# Altium schematic sheet CosmoLink_Alpha_V0.00.SchDoc
size A
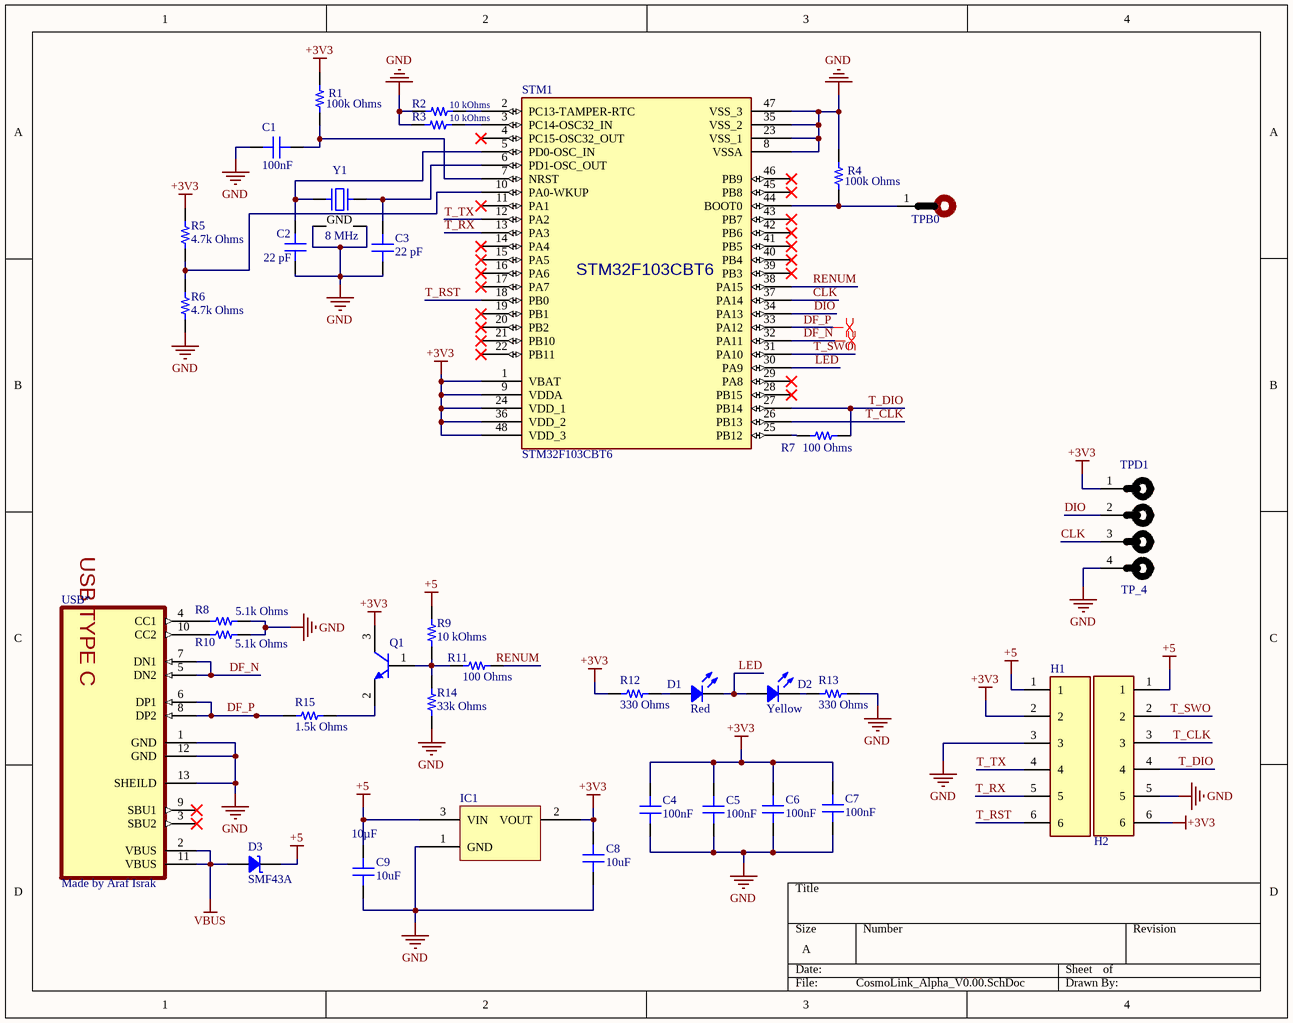
[diagram p0: CosmoLink_Alpha_V0.00.SchDoc]

## Parts
C1  Capacitance: 100nF  [CAP 0603_1608]  (hidden comment: 0.1µF)
C2  22 pF  [CAP 0603_1608]
C3  22 pF  [CAP 0603_1608]
C4  Capacitance: 100nF  [CAP 0603_1608]  (hidden comment: 0.1µF)
C5  Capacitance: 100nF  [CAP 0603_1608]  (hidden comment: 0.1µF)
C6  Capacitance: 100nF  [CAP 0603_1608]  (hidden comment: 0.1µF)
C7  Capacitance: 100nF  [CAP 0603_1608]  (hidden comment: 0.1µF)
C8  Capacitance: 10uF  [CAP 0603_1608]  (hidden comment: 10µF)
C9  Capacitance: 10uF  [CAP 0603_1608]  (hidden comment: 10µF)
D1  Red  [LED 0603_1608 RED]
D2  Yellow  [LED 0603_1608 YELLOW]
D3  SMF43A  [SOD123F]
H1  2.54mm_TH_1x6_pin_header  [2.54mm_TH_1x6_pin_header]  (value not drawn)
H2  2.54mm_TH_1x6_pin_header  [2.54mm_TH_1x6_pin_header]  (value not drawn)
IC1  AP2138N-3.3TRG1  [DIODES SOT-23-3 N]  (value not drawn)
Q1  DNLS160-7  [DIODES SOT-23-3]  (value not drawn)
R1  100k Ohms  [RES 0603_1608]
R2  10 kOhms  [RES 0603_1608]
R3  10 kOhms  [RES 0603_1608]
R4  100k Ohms  [RES 0603_1608]
R5  4.7k Ohms  [RES 0603_1608]
R6  4.7k Ohms  [RES 0603_1608]
R7  100 Ohms  [RES 0603_1608]
R8  5.1k Ohms  [RES 0603_1608]
R9  10 kOhms  [RES 0603_1608]
R10  5.1k Ohms  [RES 0603_1608]
R11  100 Ohms  [RES 0603_1608]
R12  330 Ohms  [RES 0603_1608]
R13  330 Ohms  [RES 0603_1608]
R14  33k Ohms  [RES 0603_1608]
R15  1.5k Ohms  [RES 0603_1608]
STM1  STM32F103CBT6  [STM32F103CBT6_FOOTPRINT]
TPB0  TP_1  [TP1]  (value not drawn)
TPD1  TP_4  [TP4]
USB*  Made by Araf Israk  [USB TYPE-C 24P SMD]
Y1  8 MHz  [EPSON TSX-3225]

## Nets
+3V3: C4.2 C5.2 C6.2 C7.2 C8.2 H1.2 H2.6 IC1.2(VOUT) Q1.3(C) R1.1 R5.2 R12.1 STM1.1(VBAT) STM1.9(VDDA) STM1.24(VDD_1) STM1.36(VDD_2) STM1.48(VDD_3) TPD1.1(TP1)
+5: C9.2 D3.2 H1.1 H2.1 IC1.3(VIN) R9.2
GND: C1.1 C2.1 C3.1 C4.1 C5.1 C6.1 C7.1 C8.1 C9.1 H1.3 H2.5 IC1.1(GND) R2.1 R3.1 R4.1 R6.1 R8.2 R10.2 R13.2 R14.1 STM1.8(VSSA) STM1.23(VSS_1) STM1.35(VSS_2) STM1.47(VSS_3) TPD1.4(TP4) USB*.1(GND) USB*.12(GND) USB*.13(SHEILD) Y1.2(GND) Y1.4(GND)
VBUS: D3.1 USB*.2(VBUS) USB*.11(VBUS)
CLK: STM1.37(PA14) TPD1.3(TP3)
DF_N: STM1.32(PA11) USB*.5(DN2) USB*.7(DN1)
DF_P: R15.1 STM1.33(PA12) USB*.6(DP1) USB*.8(DP2)
DIO: STM1.34(PA13) TPD1.2(TP2)
LED: D1.2 D2.1 STM1.30(PA9)
RENUM: R11.2 STM1.38(PA15)
T_CLK: H2.3 STM1.26(PB13)
T_DIO: H2.4 R7.2 STM1.27(PB14)
T_RST: H1.6 STM1.18(PB0)
T_RX: H1.5 STM1.13(PA3)
T_SWO: H2.2 STM1.31(PA10)
T_TX: H1.4 STM1.12(PA2)
NetC1_2: C1.2 R1.2 STM1.7(NRST)
NetC2_2: C2.2 STM1.5(PD0-OSC_IN) Y1.1
NetC3_2: C3.2 STM1.6(PD1-OSC_OUT) Y1.3
NetD1_1: D1.1 R12.2
NetD2_2: D2.2 R13.1
NetQ1_1: Q1.1(B) R9.1 R11.1 R14.2
NetQ1_2: Q1.2(E) R15.2
NetR2_2: R2.2 STM1.2(PC13-TAMPER-RTC)
NetR3_2: R3.2 STM1.3(PC14-OSC32_IN)
NetR4_2: R4.2 STM1.44(BOOT0) TPB0.1(TP1)
NetR5_1: R5.1 R6.2 STM1.10(PA0-WKUP)
NetR7_1: R7.1 STM1.25(PB12)
NetR8_1: R8.1 USB*.4(CC1)
NetR10_1: R10.1 USB*.10(CC2)

Not connected (* = marked no-connect by the designer): STM1 4(PC15-OSC32_OUT)* 11(PA1)* 14(PA4)* 15(PA5)* 16(PA6)* 17(PA7)* 19(PB1)* 20(PB2)* 21(PB10)* 22(PB11)* 28(PB15)* 29(PA8)* 39(PB3)* 40(PB4)* 41(PB5)* 42(PB6)* 43(PB7)* 45(PB8)* 46(PB9)*; USB* 3(SBU2)* 9(SBU1)*

## Layout directives
differential pair: DF_N, DF_P

## Notes on the sheet
- (in symbol USB TYPE-C 24P SMD) USB TYPE C

## Library data of the parts
C1 C4-C9 = 06031C104KAT2A: CAP CER 0.1UF 100V X7R 0603; manufacturer: AVX Corporation; Tolerance: ±10%; Part Number: 06031C104KAT2A; Applications: General Purpose; componentlink1description: Datasheet; componentlink1url: http://datasheets.avx.com/X7RDielectric.pdf; componentlink2description: DigiKey Link; componentlink2url: http://digikey.com/product-detail/en/avx-corporation/06031C104KAT2A/478-10047-1-ND/6564270; Device Package: 0603 (1608 Metric); lastupdated: 9/2/2020 1:03:14 AM; Lifecycle Status: Active; Minimum Order: 1; Mounting Type: Surface Mount, MLCC; Operating Temperature: -55°C ~ 125°C; Package / Case: 0603 (1608 Metric); packaging: TapeAndReel; partid: 14077; Part Status: Active; price: 0.03; series: -; Size / Dimension: 0.063" L x 0.032" W (1.60mm x 0.81mm); Supplier 1: DigiKey; Supplier Part Number 1: 478-10047-1-ND; Temperature Coefficient: X7R; Thickness (Max): 0.037" (0.94mm); Voltage - Rated: 100V
  C1 C4-C7: value: 0.1µF
  C8 C9: value: 10µF
C2 C3 = C06CF220F-9ZN-X0T: HIGH-Q MLCC (CF): 0603, 22 PF (1; manufacturer: Knowles Dielectric Labs; Temperature Coefficient: C0G, NP0; Tolerance: ±1%; Voltage - Rated: 250V; Part Number: C06CF220F-9ZN-X0T; Capacitance: 22 pF; Applications: RF, Microwave, High Frequency; componentlink1description: Datasheet; componentlink1url: https://media.digikey.com/pdf/Data%20Sheets/Knowles%20Dielectric%20Labs%20PDFs/MLC_SLC_Cap_Cat.pdf; componentlink2description: DigiKey Link; componentlink2url: https://www.digikey.com/en/products/detail/knowles-dielectric-labs/C06CF220F-9ZN-X0T/19203937; Device Package: 0603 (1608 Metric); Features: High Q, Low Loss; lastupdated: 2/9/2024 8:08:55 PM; Lifecycle Status: Active; Minimum Order: 1; Mounting Type: Surface Mount, MLCC; Operating Temperature: -55°C ~ 125°C; Package / Case: 0603 (1608 Metric); packaging: TapeAndReel; partid: 55085; Part Status: Active; price: 2.56; series: CF; Size / Dimension: 0.060" L x 0.030" W (1.52mm x 0.76mm); Supplier 1: DigiKey; Supplier Part Number 1: 1761-C06CF220F-9ZN-X0TCT-ND; Thickness (Max): 0.031" (0.80mm); value: 22 pF
D1 = VFHR1111C-3BY2A-TR: LED RED DIFFUSED 1608 SMD; Manufacturer: Stanley Electric Co; Configuration: Standard; Current - Test: 20mA; Lens Color: White; Lens Size: 1.10mm x 0.80mm; Lens Style: Rectangle with Flat Top; Millicandela Rating: 91mcd; Viewing Angle: 140°; Voltage - Forward (Vf) (Typ): 1.9V; Wavelength - Dominant: 626nm; Wavelength - Peak: 635nm; Part Number: VFHR1111C-3BY2A-TR; Color: Red; ComponentLink1Description: Datasheet; ComponentLink1URL: http://www.stanley-components.com/php/downloaddatafile.php?rp=0,VFHR1111C-3BY2A-TR_e.pdf; ComponentLink2Description: DigiKey Link; ComponentLink2URL: https://www.digikey.com/en/products/detail/stanley-electric-co/VFHR1111C-3BY2A-TR/6615658; Device Package: 0603 (1608 Metric); Height (Max): 0.80mm; LastUpdated: 6/3/2024 7:59:48 PM; Lens Transparency: Diffused; Lifecycle Status: Active; Minimum Order: 1; Mounting Type: Surface Mount; Package / Case: 0603 (1608 Metric); Packaging: TapeAndReel; PartId: 373; Part Status: Active; Price: 0.06; Series: -; Size / Dimension: 1.60mm L x 0.80mm W; Supplier 1: DigiKey; Supplier Part Number 1: 404-1310-1-ND; Supplier Device Package: 1608; Value: Red
D2 = 5973405507F: LED YELLOW 0603 SMD; Manufacturer: Dialight; Configuration: Standard; Current - Test: 20mA; Lens Color: 0.68mm; Lens Size: 1.20mm x 0.80mm; Lens Style: Rectangle with Flat Top; Millicandela Rating: 224mcd; Voltage - Forward (Vf) (Typ): 2.1V; Wavelength - Dominant: 590nm; Part Number: 5973405507F; Color: Yellow; ComponentLink1Description: Datasheet; ComponentLink1URL: http://www.dialightsignalsandcomponents.com/Assets/Drawings/2D_Drawings_DrawingDetailedSpec/NewDrawings/18369A.pdf; ComponentLink2Description: DigiKey Link; ComponentLink2URL: https://www.digikey.com/en/products/detail/dialight/5973405507F/9385433; Device Package: 0603 (1608 Metric); Height (Max): 0.68mm; LastUpdated: 6/3/2024 8:01:10 PM; Lifecycle Status: Active; Minimum Order: 1; Mounting Type: Surface Mount; Package / Case: 0603 (1608 Metric); Packaging: TapeAndReel; PartId: 87; Part Status: Active; Price: 0.08; Series: 597; Size / Dimension: 1.60mm L x 0.80mm W; Supplier 1: DigiKey; Supplier Part Number 1: 350-4378-1-ND; Supplier Device Package: 0603; Value: Yellow
D3 = SMF43A: TVS SOD123FL 43V 200W UNIDIR; Manufacturer: Littelfuse Inc.; Current - Peak Pulse (10/1000µs): 2.9A; Power Line Protection: No; Type: Zener; Unidirectional Channels: 1; Voltage - Breakdown (Min): 47.8V; Voltage - Clamping (Max) @ Ipp: 69.4V; Part Number: SMF43A; Applications: General Purpose; ComponentLink1Description: Datasheet; ComponentLink1URL: https://www.littelfuse.com/~/media/electronics/datasheets/tvs_diodes/littelfuse_tvs_diode_smf_datasheet.pdf.pdf; ComponentLink2Description: DigiKey Link; ComponentLink2URL: https://www.digikey.com/en/products/detail/littelfuse-inc/SMF43A/3672410; LastUpdated: 6/3/2024 8:22:37 PM; Lifecycle Status: Active; Minimum Order: 1; Mounting Type: Surface Mount; Operating Temperature: -55°C ~ 150°C (TJ); Package / Case: SOD-123F; Packaging: TapeAndReel; PartId: 10081; Part Status: Active; Power - Peak Pulse: 200W; Price: 0.08; Series: SMF; Supplier 1: DigiKey; Supplier Part Number 1: F5830CT-ND; Supplier Device Package: SOD-123F; Voltage - Reverse Standoff (Typ): 43V
IC1 = AP2138N-3.3TRG1: IC REG LINEAR 3.3V 250MA SOT23-3; Manufacturer: Diodes Incorporated; Current - Quiescent (Iq): 1.5 µA; Number of Regulators: 1; Output Configuration: Positive; Output Type: Fixed; Protection Features: Over Current; Voltage Dropout (Max): 0.6V @ 250mA; Voltage - Input (Max): 6V; Part Number: AP2138N-3.3TRG1; ComponentLink1Description: Datasheet; ComponentLink1URL: https://www.diodes.com/assets/Datasheets/AP2138-9.pdf; ComponentLink2Description: DigiKey Link; ComponentLink2URL: https://www.digikey.com/en/products/detail/diodes-incorporated/AP2138N-3-3TRG1/4470804; Current - Output: 250mA; LastUpdated: 6/3/2024 8:26:00 PM; Lifecycle Status: Active; Minimum Order: 1; Mounting Type: Surface Mount; Operating Temperature: -40°C ~ 85°C (TA); Package / Case: TO-236-3, SC-59, SOT-23-3; Packaging: TapeAndReel; Part Status: Active; Price: 0.08; Series: -; Supplier 1: DigiKey; Supplier Part Number 1: AP2138N-3.3TRG1DICT-ND; Supplier Device Package: SOT-23-3; Voltage - Output (Min/Fixed): 3.3V
Q1 = DNLS160-7: TRANS NPN 60V 1A SOT23-3; Manufacturer: Diodes Incorporated; Current - Collector Cutoff (Max): 100nA; DC Current Gain (hFE) (Min) @ Ic, Vce: 200 @ 500mA, 5V; Frequency - Transition: 270MHz; Power - Max: 300mW; Vce Saturation (Max) @ Ib, Ic: 250mV @ 100mA, 1A; Part Number: DNLS160-7; ComponentLink1Description: Datasheet; ComponentLink1URL: https://www.diodes.com/assets/Datasheets/ds31390.pdf; ComponentLink2Description: DigiKey Link; ComponentLink2URL: http://digikey.com/product-detail/en/diodes-incorporated/DNLS160-7/DNLS160DICT-ND/1964776; Current - Collector (Ic) (Max): 1A; LastUpdated: 6/3/2024 8:24:10 PM; Lifecycle Status: Active; Minimum Order: 1; Mounting Type: Surface Mount; Operating Temperature: -55°C ~ 150°C (TJ); Package / Case: TO-236-3, SC-59, SOT-23-3; Packaging: CutTape; PartId: 44; Part Status: Active; Price: 0.45; Series: -; Supplier 1: DigiKey; Supplier Part Number 1: DNLS160DICT-ND; Supplier Device Package: SOT-23-3; Transistor Type: NPN; Voltage - Collector Emitter Breakdown (Max): 60V
R1-R4 R9 = RNCS0603BKE10K0: RES 10K OHM 0.1% 1/16W 0603; Manufacturer: Stackpole Electronics Inc; Power (Watts): 0.063W, 1/16W; Temperature Coefficient: ±25ppm/°C; Part Number: RNCS0603BKE10K0; ComponentLink1Description: Datasheet; ComponentLink1URL: https://www.seielect.com/catalog/sei-rncs_rnch.pdf; ComponentLink2Description: DigiKey Link; ComponentLink2URL: https://www.digikey.com/en/products/detail/stackpole-electronics-inc/RNCS0603BKE10K0/1708836; Composition: Thin Film; Device Package: 0603 (1608 Metric); Features: Anti-Corrosive, Automotive AEC-Q200, Moisture Resistant; Height - Seated (Max): 0.022" (0.55mm); LastUpdated: 2/9/2024 8:43:37 PM; Lifecycle Status: Active; Minimum Order: 1; Number of Terminations: 2; Operating Temperature: -55°C ~ 155°C; Package / Case: 0603 (1608 Metric); Packaging: TapeAndReel; PartId: 4838; Part Status: Active; Price: 0.06; Ratings: AEC-Q200; Series: RNCS; Size / Dimension: 0.061" L x 0.031" W (1.55mm x 0.80mm); Supplier 1: DigiKey; Supplier Part Number 1: RNCS0603BKE10K0CT-ND; Supplier Device Package: 0603; Tolerance: ±0.1%
  R1 R4: Value: 100k Ohms; Resistance: 100 kOhms
  R2 R3 R9: Value: 10 kOhms; Resistance: 10 kOhms
R5-R8 R10-R15 = RNCS0603BKE10K0: RES 10K OHM 0.1% 1/16W 0603; Manufacturer: Stackpole Electronics Inc; Power (Watts): 0.063W, 1/16W; Resistance: 100 kOhms; Temperature Coefficient: ±25ppm/°C; Part Number: RNCS0603BKE10K0; ComponentLink1Description: Datasheet; ComponentLink1URL: https://www.seielect.com/catalog/sei-rncs_rnch.pdf; ComponentLink2Description: DigiKey Link; ComponentLink2URL: https://www.digikey.com/en/products/detail/stackpole-electronics-inc/RNCS0603BKE10K0/1708836; Composition: Thin Film; Device Package: 0603 (1608 Metric); Features: Anti-Corrosive, Automotive AEC-Q200, Moisture Resistant; Height - Seated (Max): 0.022" (0.55mm); LastUpdated: 2/9/2024 8:43:37 PM; Lifecycle Status: Active; Minimum Order: 1; Number of Terminations: 2; Operating Temperature: -55°C ~ 155°C; Package / Case: 0603 (1608 Metric); Packaging: TapeAndReel; PartId: 4838; Part Status: Active; Price: 0.06; Ratings: AEC-Q200; Series: RNCS; Size / Dimension: 0.061" L x 0.031" W (1.55mm x 0.80mm); Supplier 1: DigiKey; Supplier Part Number 1: RNCS0603BKE10K0CT-ND; Supplier Device Package: 0603; Tolerance: ±0.1%
  R5 R6: Value: 4.7k Ohms
  R7 R11: Value: 100 Ohms
  R8 R10: Value: 5.1k Ohms
  R12 R13: Value: 330 Ohms
  R14: Value: 33k Ohms
  R15: Value: 1.5k Ohms
STM1 = STM32F103CBT6: 128KB 2V~3.6V ARM-M3 20KB 72MHz FLASH 37 LQFP-48(7x7) Microcontrollers (MCU/MPU/SOC) ROHS; JLCPCB Part #: C8304; Package: LQFP-48; MFR.Part #: STM32F103CBT6; ComponentLink1Description: Datasheet; ComponentLink1URL: https://www.st.com/resource/en/datasheet/cd00161566.pdf; ComponentLink2Description: JLCPCB Parts; ComponentLink2URL: https://jlcpcb.com/partdetail/Stmicroelectronics-STM32F103CBT6/C8304
USB* = USB TYPE-C 24P SMD: USB Type: TYPE-C 16PIN / 24PIN; Gender: Female; Current Rating: 5 Amp; Voltage Rating: 3.3V - 48V; Pin Number: 16; ComponentLink1Description: lcsc; ComponentLink1URL: https://www.lcsc.com/product-detail/USB-Connectors_SHOU-HAN-TYPE-C-16PIN-2MD-073_C2765186.html; ComponentLink2Description: datasheet 1; ComponentLink2URL: https://www.lcsc.com/datasheet/lcsc_datasheet_2111231930_SHOU-HAN-TYPE-C-16PIN-2MD-073_C2765186.pdf; ComponentLink3Description: datasheet 2; ComponentLink3URL: https://www.digikey.com/en/products/detail/gct/USB4105-GF-A/11198441; ComponentLink4Description: aliexpress; ComponentLink4URL: https://www.aliexpress.com/item/1005006353547160.html?spm=a2g0o.order_list.order_list_main.61.296f18023vUA5z; LCSC Part: C2765186; Stock: ~30
Y1 = TSX-3225 16.0000MF10U-B0: CRYSTAL 16.0000MHZ 16PF SMD; Manufacturer: EPSON; ESR (Equivalent Series Resistance): 60 Ohms; Frequency: 16 MHz; Frequency Stability: ±10ppm; Operating Mode: Fundamental; Part Number: TSX-3225 16.0000MF10U-B0; ComponentLink1Description: Datasheet; ComponentLink1URL: https://support.epson.biz/td/api/doc_check.php?dl=brief_TSX-3225&lang=en; ComponentLink2Description: DigiKey Link; ComponentLink2URL: https://www.digikey.com/en/products/detail/epson/TSX-3225-16-0000MF10U-B0/5260851; Frequency Tolerance: ±10ppm; Height - Seated (Max): 0.024" (0.60mm); LastUpdated: 6/3/2024 8:02:15 PM; Lifecycle Status: Active; Load Capacitance: 16pF; Minimum Order: 1; Mounting Type: Surface Mount; Operating Temperature: -10°C ~ 60°C; Package / Case: 4-SMD, No Lead; Packaging: TapeAndReel; PartId: 436; Part Status: Active; Price: 0.20; Series: TSX-3225; Size / Dimension: 0.126" L x 0.098" W (3.20mm x 2.50mm); Supplier 1: DigiKey; Supplier Part Number 1: SER4370CT-ND; Type: MHz Crystal; Value: 8 MHz